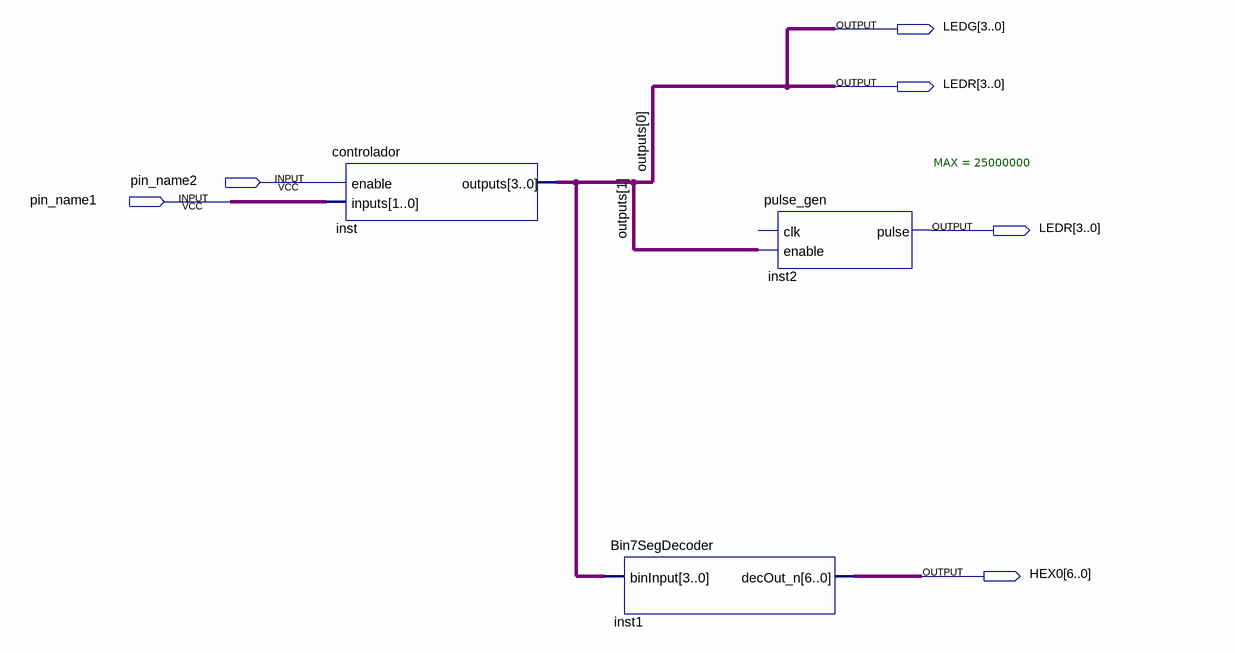
[diagram p0: schematic sheet]
// Quartus schematic miniProjDemo.bdf as structural Verilog: 3 symbols, 6 pins
module miniProjDemo (
  input  pin_name2,
  input  pin_name1,
  output [3:0] LEDG,
  output [3:0] LEDR,
  output [6:0] HEX0
);

  wire [1:0] outputs, undriven;

  controlador inst (.enable(pin_name2), .inputs(undriven), .outputs(outputs[0]));
  Bin7SegDecoder inst1 (.binInput({4{outputs[0]}}), .decOut_n(HEX0));
  pulse_gen #(.MAX(25000000)) inst2 (.enable(outputs[1]), .pulse(LEDG));  // open: clk

  assign LEDR = LEDG;
endmodule
